# Altium project Psoc robot.PrjPcb
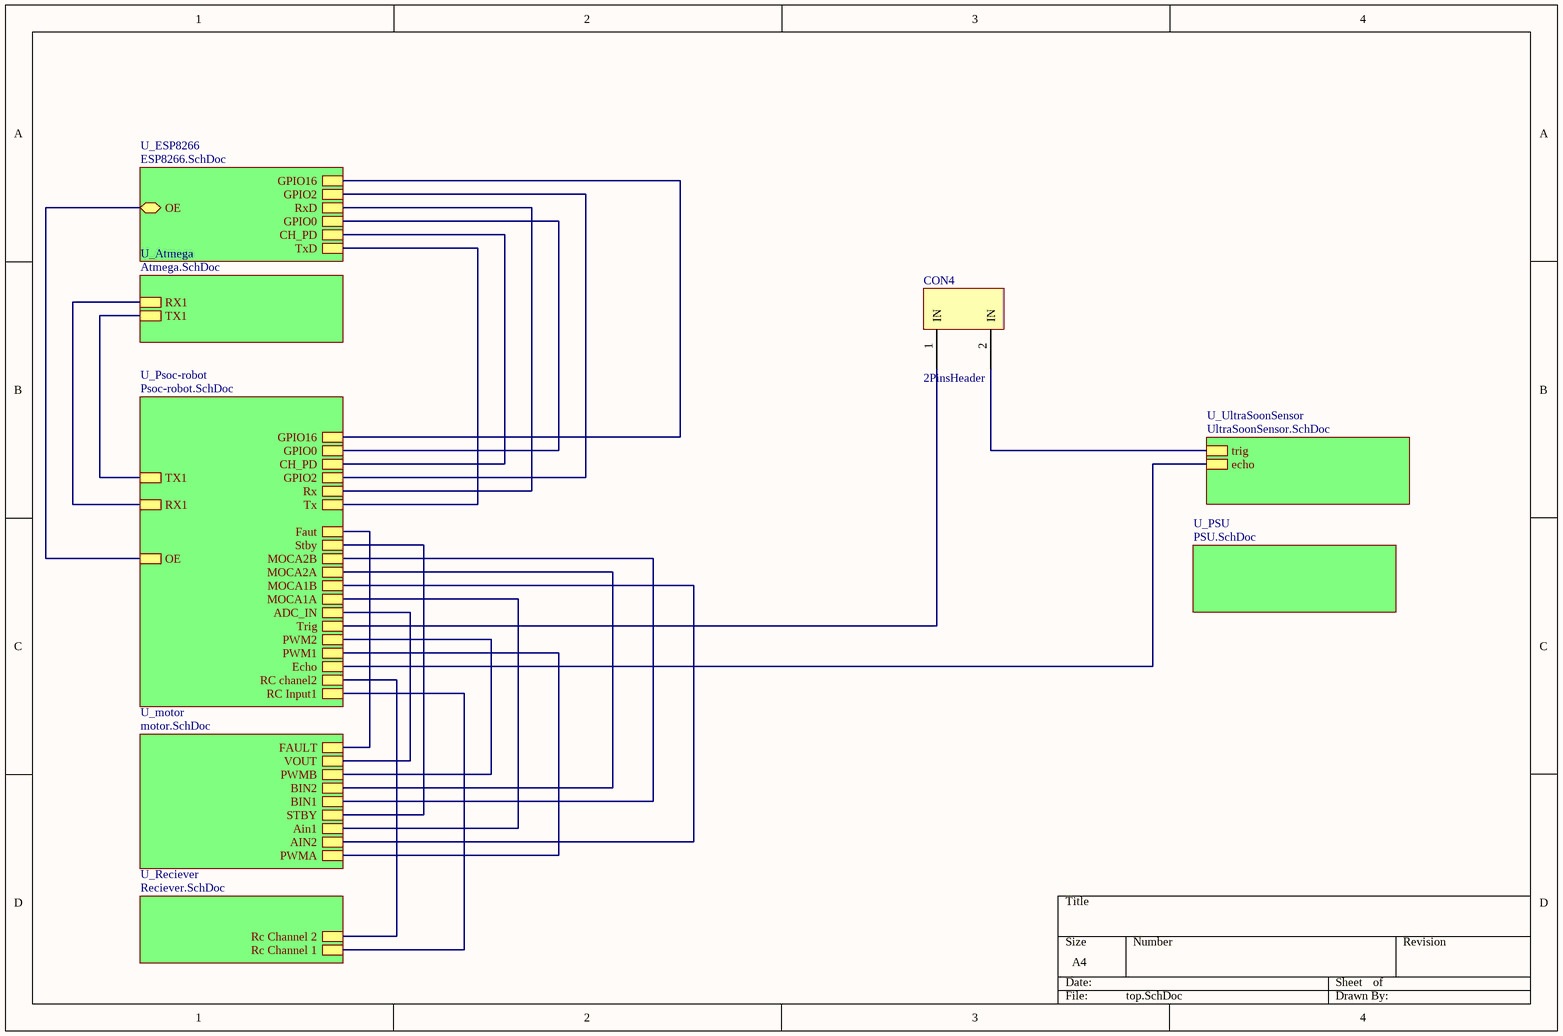
[diagram p0: top.SchDoc]
8 sheets, 48 parts. Net scope: hierarchical (ports join the sheet entries above them; power ports are global).
Board file: PsocrobotWhitESP8266.PcbDoc
Sheets:
  top.SchDoc
    U_ESP8266 = ESP8266.SchDoc
    U_UltraSoonSensor = UltraSoonSensor.SchDoc
    U_motor = motor.SchDoc
    U_PSU = PSU.SchDoc
    U_Reciever = Reciever.SchDoc
    U_Atmega = Atmega.SchDoc
    U_Psoc-robot = Psoc-robot.SchDoc

## Sheet top.SchDoc
size A4; SheetNumber: 2

### Parts
CON4  2PinsHeader  [2PinsHeader]

### Sub-sheets
U_Atmega = Atmega.SchDoc: RX1, TX1
U_ESP8266 = ESP8266.SchDoc: TxD, CH_PD, GPIO0, RxD, GPIO2, GPIO16, OE
U_motor = motor.SchDoc: PWMA, AIN2, Ain1, STBY, BIN1, BIN2, PWMB, VOUT, FAULT
U_Psoc-robot = Psoc-robot.SchDoc: RC Input1, RC chanel2, Echo, PWM1, PWM2, Trig, ADC_IN, MOCA1A, MOCA1B, MOCA2A, MOCA2B, Stby, Faut, Tx, Rx, GPIO2, CH_PD, GPIO0, GPIO16, OE, RX1, TX1
U_PSU = PSU.SchDoc: no entries
U_Reciever = Reciever.SchDoc: Rc Channel 1, Rc Channel 2
U_UltraSoonSensor = UltraSoonSensor.SchDoc: trig, echo

### Nets
NetCON4_1: CON4.1(IN) ; sheet U_Psoc-robot/Trig
NetCON4_2: CON4.2(IN) ; sheet U_UltraSoonSensor/trig
NetCON6_1: sheet U_Reciever/Rc Channel 1, sheet U_Psoc-robot/RC Input1
NetCON7_1: sheet U_Reciever/Rc Channel 2, sheet U_Psoc-robot/RC chanel2
NetR1_2: sheet U_motor/FAULT, sheet U_Psoc-robot/Faut
NetU1_15: sheet U_motor/PWMB, sheet U_Psoc-robot/PWM2
NetU1_16: sheet U_motor/BIN2, sheet U_Psoc-robot/MOCA2A
NetU1_17: sheet U_motor/BIN1, sheet U_Psoc-robot/MOCA2B
NetU1_19: sheet U_motor/STBY, sheet U_Psoc-robot/Stby
NetU1_21: sheet U_motor/Ain1, sheet U_Psoc-robot/MOCA1A
NetU1_22: sheet U_motor/AIN2, sheet U_Psoc-robot/MOCA1B
NetU1_23: sheet U_motor/PWMA, sheet U_Psoc-robot/PWM1
NetU2_7: sheet U_motor/VOUT, sheet U_Psoc-robot/ADC_IN
NetU3_1: sheet U_ESP8266/RxD, sheet U_Psoc-robot/Rx
NetU3_3: sheet U_UltraSoonSensor/echo, sheet U_Psoc-robot/Echo
NetU3_12: sheet U_Atmega/RX1, sheet U_Psoc-robot/RX1
NetU3_16: sheet U_ESP8266/GPIO16, sheet U_Psoc-robot/GPIO16
NetU3_17: sheet U_ESP8266/GPIO0, sheet U_Psoc-robot/GPIO0
NetU3_18: sheet U_ESP8266/CH_PD, sheet U_Psoc-robot/CH_PD
NetU3_20: sheet U_ESP8266/GPIO2, sheet U_Psoc-robot/GPIO2
NetU3_21: sheet U_ESP8266/OE, sheet U_Psoc-robot/OE
NetU3_25: sheet U_ESP8266/TxD, sheet U_Psoc-robot/Tx
NetU3_27: sheet U_Atmega/TX1, sheet U_Psoc-robot/TX1

## Sheet ESP8266.SchDoc
size A4; SheetNumber: 3
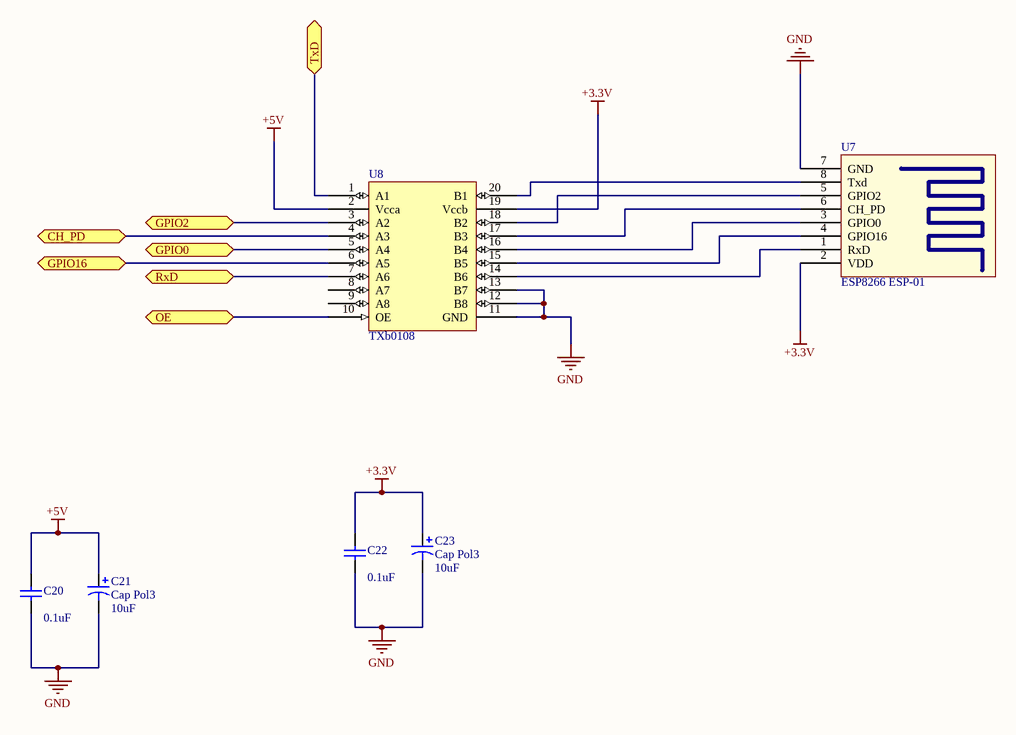
[diagram p1: ESP8266.SchDoc]

### Parts
C20  value 0.1uF  [C1206]  (hidden comment: Cap Semi)
C21  Cap Pol3  value 10uF  [C0805]
C22  value 0.1uF  [C1206]  (hidden comment: Cap Semi)
C23  Cap Pol3  value 10uF  [C0805]
U7  ESP8266 ESP-01  [ESP8266 ESP-01]
U8  TXb0108  [TXB0108]

### Ports
CH_PD, GPIO0, GPIO2, GPIO16, OE, RxD, TxD

### Nets
+3.3V: C22.1 C23.1 U7.2(VDD) U8.19(Vccb)
+5V: C20.1 C21.1 U8.2(Vcca)
GND: C20.2 C21.2 C22.2 C23.2 U7.7(GND) U8.11(GND) U8.12(B8) U8.13(B7)
NetU3_1: U8.7(A6) ; port RxD
NetU3_16: U8.6(A5) ; port GPIO16
NetU3_17: U8.5(A4) ; port GPIO0
NetU3_18: U8.4(A3) ; port CH_PD
NetU3_20: U8.3(A2) ; port GPIO2
NetU3_21: U8.10(OE) ; port OE
NetU3_25: U8.1(A1) ; port TxD
NetU7_1: U7.1(RxD) U8.14(B6)
NetU7_3: U7.3(GPIO0) U8.16(B4)
NetU7_4: U7.4(GPIO16) U8.15(B5)
NetU7_5: U7.5(GPIO2) U8.18(B2)
NetU7_6: U7.6(CH_PD) U8.17(B3)
NetU7_8: U7.8(Txd) U8.20(B1)

Not connected (* = marked no-connect by the designer): U8 8(A7) 9(A8)

### Library data of the parts
C20 C22 = Cap Semi: Capacitor (Semiconductor SIM Model); Published: 8-Jun-2000; LatestRevisionDate: 29-May-2009; LatestRevisionNote: IPC-7351 Footprint Added.; PackageReference: C1206; Publisher: Altium Limited; PackageDescription: Chip Capacitor
C21 C23 = Cap Pol3: Polarized Capacitor (Surface Mount); Published: 8-Jun-2000; LatestRevisionDate: 29-May-2009; LatestRevisionNote: IPC-7351 Footprint Added.; PackageReference: C0805; Publisher: Altium Limited; PackageDescription: Chip Capacitor

## Sheet UltraSoonSensor.SchDoc
size A4; SheetNumber: 6
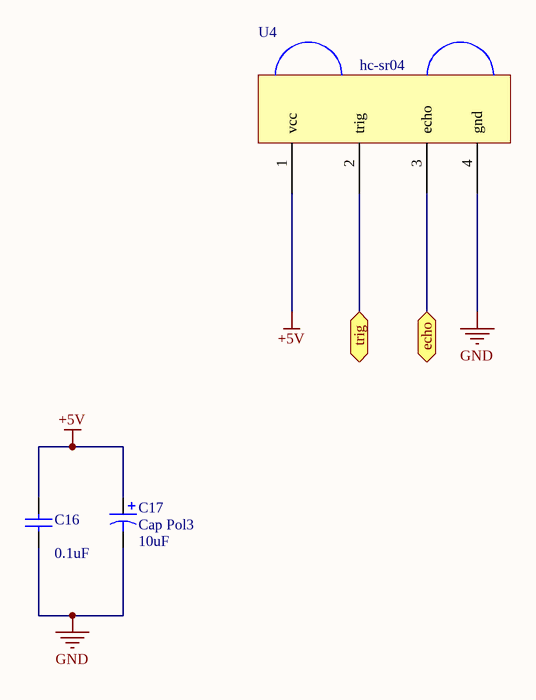
[diagram p2: UltraSoonSensor.SchDoc]

### Parts
C16  value 0.1uF  [C1206]  (hidden comment: Cap Semi)
C17  Cap Pol3  value 10uF  [C0805]
U4  hc-sr04  [ultrasoonSensor]

### Ports
echo, trig

### Nets
+5V: C16.1 C17.1 U4.1(vcc)
GND: C16.2 C17.2 U4.4(gnd)
NetCON4_2: U4.2(trig) ; port trig
NetU3_3: U4.3(echo) ; port echo

### Library data of the parts
C16 = Cap Semi: Capacitor (Semiconductor SIM Model); Published: 8-Jun-2000; LatestRevisionDate: 29-May-2009; LatestRevisionNote: IPC-7351 Footprint Added.; PackageReference: C1206; Publisher: Altium Limited; PackageDescription: Chip Capacitor
C17 = Cap Pol3: Polarized Capacitor (Surface Mount); Published: 8-Jun-2000; LatestRevisionDate: 29-May-2009; LatestRevisionNote: IPC-7351 Footprint Added.; PackageReference: C0805; Publisher: Altium Limited; PackageDescription: Chip Capacitor
U4 = Component_1

## Sheet motor.SchDoc
size A4; SheetNumber: 5
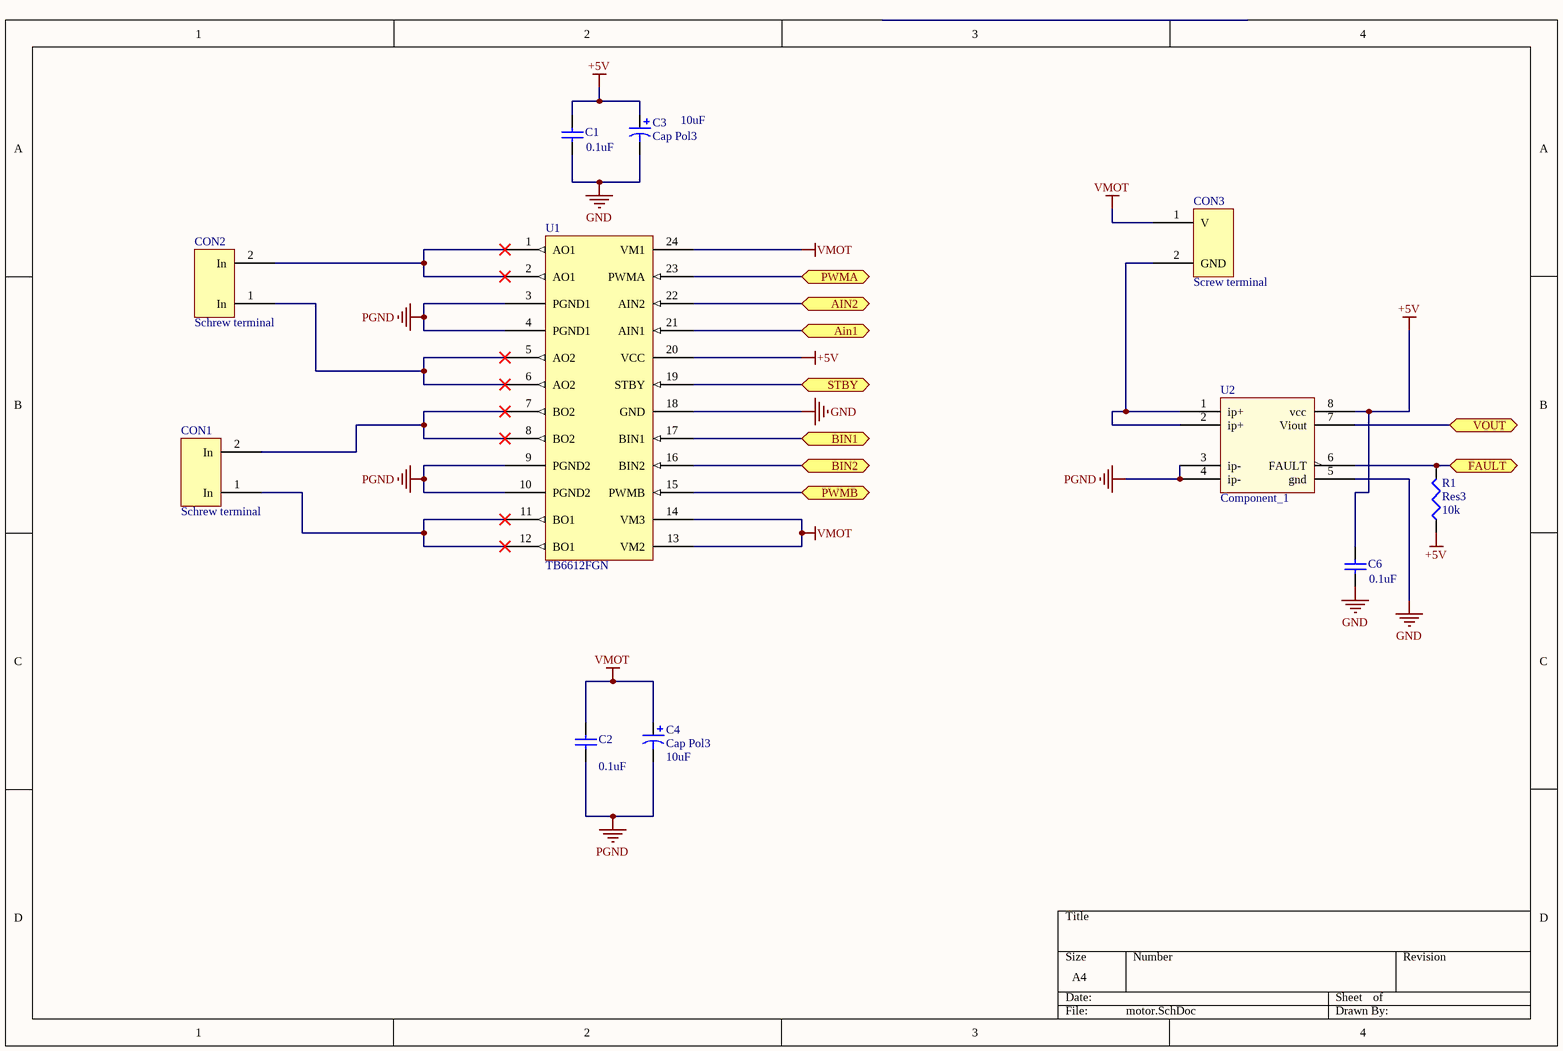
[diagram p3: motor.SchDoc]

### Parts
C1  value 0.1uF  [1608[0603]]  (hidden comment: Cap Semi)
C2  value 0.1uF  [C1206]  (hidden comment: Cap Semi)
C3  Cap Pol3  value 10uF  [C0805]
C4  Cap Pol3  value 10uF  [C0805]
C6  value 0.1uF  [1608[0603]]  (hidden comment: Cap Semi)
CON1  Schrew terminal  [ScrewTerminal]
CON2  Schrew terminal  [ScrewTerminal]
CON3  Screw terminal  [ScrewTerminal]
R1  Res3  value 10k  [J1-0603]
U1  TB6612FGN  [TBS6612FNG]
U2  Component_1  [ACS711]

### Ports
Ain1, AIN2, BIN1, BIN2, FAULT, PWMA, PWMB, STBY, VOUT

### Nets
+5V: C1.1 C3.1 C6.1 R1.1 U1.20(VCC) U2.8(vcc)
GND: C1.2 C3.2 C6.2 U1.18(GND) U2.5(gnd)
PGND: C2.2 C4.2 U1.3(PGND1) U1.4(PGND1) U1.9(PGND2) U1.10(PGND2) U2.3(ip-) U2.4(ip-)
VMOT: C2.1 C4.1 CON3.1(V) U1.13(VM2) U1.14(VM3) U1.24(VM1)
NetCON1_1: CON1.1(In) U1.11(BO1) U1.12(BO1)
NetCON1_2: CON1.2(In) U1.7(BO2) U1.8(BO2)
NetCON2_1: CON2.1(In) U1.5(AO2) U1.6(AO2)
NetCON2_2: CON2.2(In) U1.1(AO1) U1.2(AO1)
NetCON3_2: CON3.2(GND) U2.1(ip+) U2.2(ip+)
NetR1_2: R1.2 U2.6(FAULT) ; port FAULT
NetU1_15: U1.15(PWMB) ; port PWMB
NetU1_16: U1.16(BIN2) ; port BIN2
NetU1_17: U1.17(BIN1) ; port BIN1
NetU1_19: U1.19(STBY) ; port STBY
NetU1_21: U1.21(AIN1) ; port Ain1
NetU1_22: U1.22(AIN2) ; port AIN2
NetU1_23: U1.23(PWMA) ; port PWMA
NetU2_7: U2.7(Viout) ; port VOUT

### Library data of the parts
C1 C2 C6 = Cap Semi: Capacitor (Semiconductor SIM Model); Published: 8-Jun-2000; LatestRevisionDate: 29-May-2009; LatestRevisionNote: IPC-7351 Footprint Added.; PackageReference: C1206; Publisher: Altium Limited; PackageDescription: Chip Capacitor
C3 C4 = Cap Pol3: Polarized Capacitor (Surface Mount); Published: 8-Jun-2000; LatestRevisionDate: 29-May-2009; LatestRevisionNote: IPC-7351 Footprint Added.; PackageReference: C0805; Publisher: Altium Limited; PackageDescription: Chip Capacitor
CON3 = Schrew terminal
R1 = Res3: Resistor; Published: 8-Jun-2000; LatestRevisionDate: 29-May-2009; LatestRevisionNote: IPC-7351 Footprint Added.; PackageReference: J1-0603; Publisher: Altium Limited; PackageDescription: Chip Resistor

## Sheet PSU.SchDoc
size A4; SheetNumber: 1
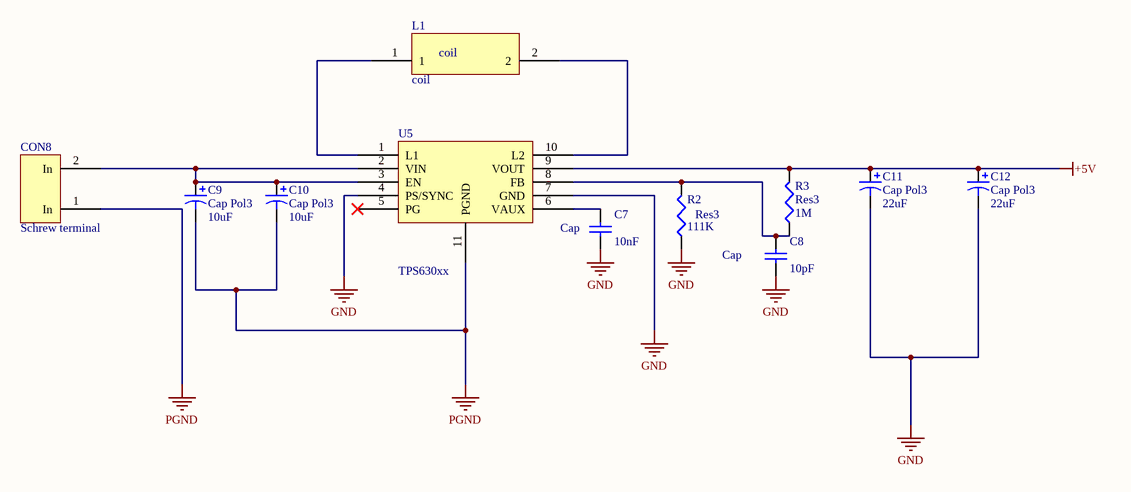
[diagram p4: PSU.SchDoc]

### Parts
C7  Cap  value 10nF  [0402]
C8  Cap  value 10pF  [0402]
C9  Cap Pol3  value 10uF  [C0805]
C10  Cap Pol3  value 10uF  [C0805]
C11  Cap Pol3  value 22uF  [C0805]
C12  Cap Pol3  value 22uF  [C0805]
CON8  Schrew terminal  [ScrewTerminal]
L1  coil  [Coil]
R2  Res3  value 111K  [J1-0603]
R3  Res3  value 1M  [J1-0603]
U5  TPS630xx  [TPS63061]

### Nets
+5V: C11.1 C12.1 R3.2 U5.9(VOUT)
GND: C7.1 C8.1 C11.2 C12.2 R2.1 U5.4(PS/SYNC) U5.7(GND)
PGND: C9.2 C10.2 CON8.1(In) U5.11(PGND)
NetC7_2: C7.2 U5.6(VAUX)
NetC8_2: C8.2 R2.2 R3.1 U5.8(FB)
NetC9_1: C9.1 C10.1 CON8.2(In) U5.2(VIN) U5.3(EN)
NetL1_1: L1.1 U5.1(L1)
NetL1_2: L1.2 U5.10(L2)

Not connected (* = marked no-connect by the designer): U5 5(PG)*

### Library data of the parts
C7 C8 = Cap Semi: Capacitor (Semiconductor SIM Model); Published: 8-Jun-2000; LatestRevisionDate: 29-May-2009; LatestRevisionNote: IPC-7351 Footprint Added.; PackageReference: C1206; Publisher: Altium Limited; PackageDescription: Chip Capacitor
C9-C12 = Cap Pol3: Polarized Capacitor (Surface Mount); Published: 8-Jun-2000; LatestRevisionDate: 29-May-2009; LatestRevisionNote: IPC-7351 Footprint Added.; PackageReference: C0805; Publisher: Altium Limited; PackageDescription: Chip Capacitor
R2 R3 = Res3: Resistor; Published: 8-Jun-2000; LatestRevisionDate: 29-May-2009; LatestRevisionNote: IPC-7351 Footprint Added.; PackageReference: J1-0603; Publisher: Altium Limited; PackageDescription: Chip Resistor

## Sheet Reciever.SchDoc
size A4; SheetNumber: 7
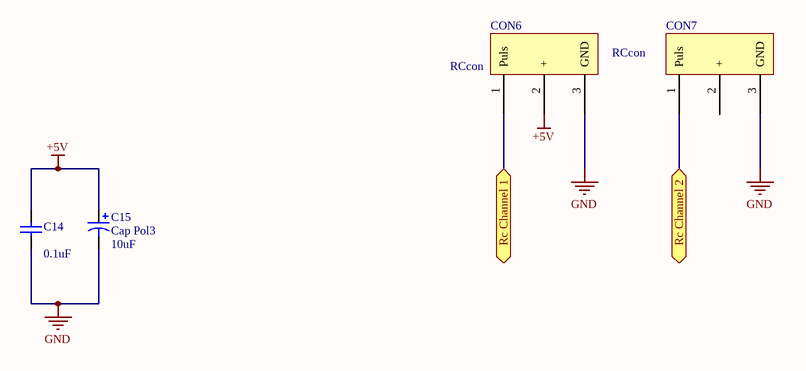
[diagram p5: Reciever.SchDoc]

### Parts
C14  value 0.1uF  [C1206]  (hidden comment: Cap Semi)
C15  Cap Pol3  value 10uF  [C0805]
CON6  RCcon  [RcCon]
CON7  RCcon  [RcCon]

### Ports
Rc Channel 1, Rc Channel 2

### Nets
+5V: C14.1 C15.1 CON6.2(+)
GND: C14.2 C15.2 CON6.3(GND) CON7.3(GND)
NetCON6_1: CON6.1(Puls) ; port Rc Channel 1
NetCON7_1: CON7.1(Puls) ; port Rc Channel 2

Not connected (* = marked no-connect by the designer): CON7 2(+)

### Library data of the parts
C14 = Cap Semi: Capacitor (Semiconductor SIM Model); Published: 8-Jun-2000; LatestRevisionDate: 29-May-2009; LatestRevisionNote: IPC-7351 Footprint Added.; PackageReference: C1206; Publisher: Altium Limited; PackageDescription: Chip Capacitor
C15 = Cap Pol3: Polarized Capacitor (Surface Mount); Published: 8-Jun-2000; LatestRevisionDate: 29-May-2009; LatestRevisionNote: IPC-7351 Footprint Added.; PackageReference: C0805; Publisher: Altium Limited; PackageDescription: Chip Capacitor
CON6 CON7 = Rc con

## Sheet Atmega.SchDoc
size A4
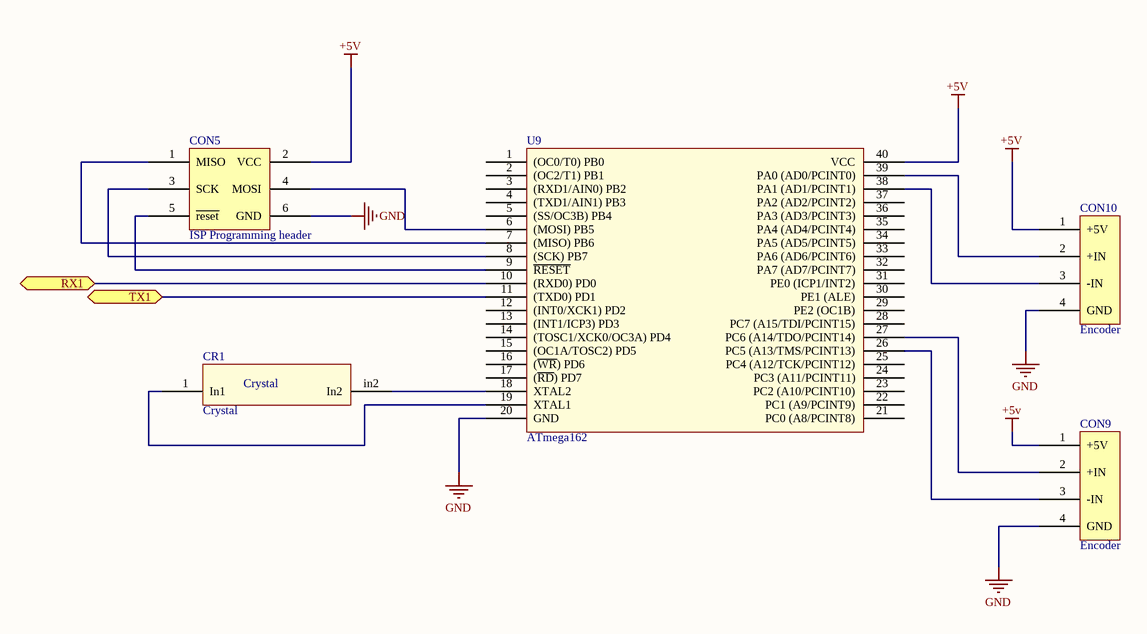
[diagram p6: Atmega.SchDoc]

### Parts
CON5  ISP Programming header  [ISP programming header]
CON9  Encoder
CON10  Encoder
CR1  Crystal  [Crystal]
U9  ATmega162  [ATmega162]

### Ports
RX1, TX1

### Nets
+5V: CON5.2(VCC) CON9.1(+5V) CON10.1(+5V) U9.40(VCC)
GND: CON5.6(GND) CON9.4(GND) CON10.4(GND) U9.20(GND)
NetCON5_1: CON5.1(MISO) U9.7((MISO)_PB6)
NetCON5_3: CON5.3(SCK) U9.8((SCK)_PB7)
NetCON5_4: CON5.4(MOSI) U9.6((MOSI)_PB5)
NetCON5_5: CON5.5(~{reset}) U9.9(~{RESET})
NetCON9_2: CON9.2(+IN) U9.27(PC6_(A14/TDO/PCINT14))
NetCON9_3: CON9.3(-IN) U9.26(PC5_(A13/TMS/PCINT13))
NetCON10_2: CON10.2(+IN) U9.39(PA0_(AD0/PCINT0))
NetCON10_3: CON10.3(-IN) U9.38(PA1_(AD1/PCINT1))
NetCR1_1: CR1.1(In1) U9.19(XTAL1)
NetCR1_in2: CR1.in2(In2) U9.18(XTAL2)
NetU3_12: U9.10((RXD0)_PD0) ; port RX1
NetU3_27: U9.11((TXD0)_PD1) ; port TX1

Not connected (* = marked no-connect by the designer): U9 1((OC0/T0)_PB0) 2((OC2/T1)_PB1) 3((RXD1/AIN0)_PB2) 4((TXD1/AIN1)_PB3) 5((SS/OC3B)_PB4) 12((INT0/XCK1)_PD2) 13((INT1/ICP3)_PD3) 14((TOSC1/XCK0/OC3A)_PD4) 15((OC1A/TOSC2)_PD5) 16((~{WR})_PD6) 17((~{RD})_PD7) 21(PC0_(A8/PCINT8)) 22(PC1_(A9/PCINT9)) 23(PC2_(A10/PCINT10)) 24(PC3_(A11/PCINT11)) 25(PC4_(A12/TCK/PCINT12)) 28(PC7_(A15/TDI/PCINT15)) 29(PE2_(OC1B)) 30(PE1_(ALE)) 31(PE0_(ICP1/INT2)) 32(PA7_(AD7/PCINT7)) 33(PA6_(AD6/PCINT6)) 34(PA5_(AD5/PCINT5)) 35(PA4_(AD4/PCINT4)) 36(PA3_(AD3/PCINT3)) 37(PA2_(AD2/PCINT2))

## Sheet Psoc-robot.SchDoc
size A4; SheetNumber: 4
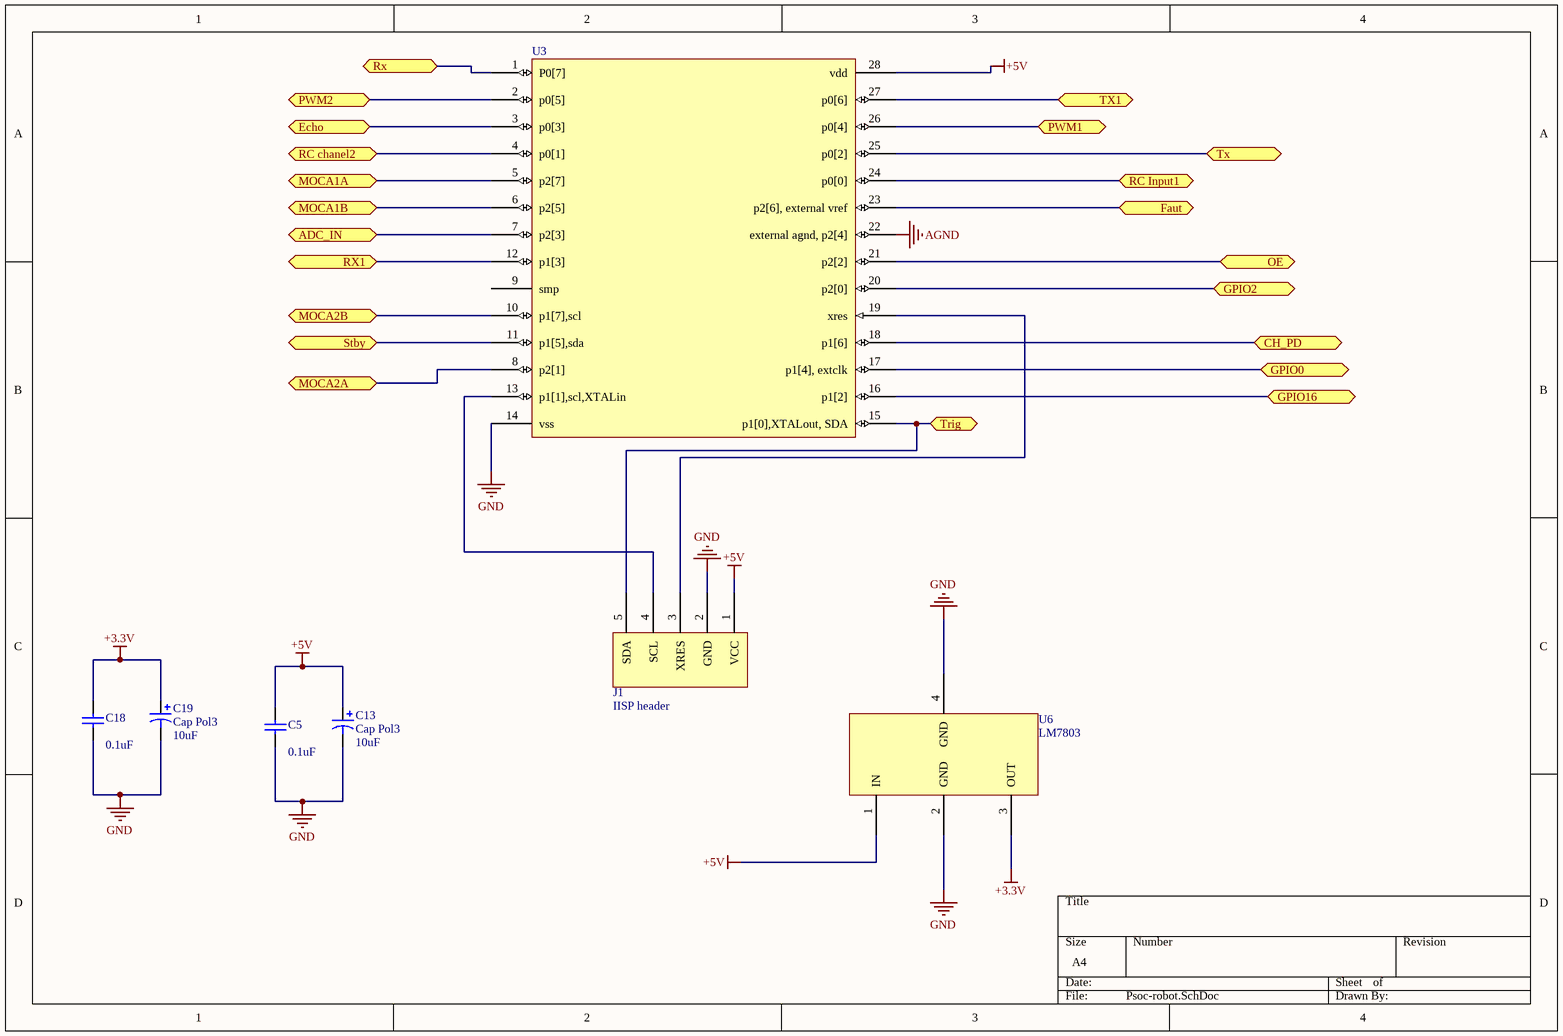
[diagram p7: Psoc-robot.SchDoc]

### Parts
C5  value 0.1uF  [C1206]  (hidden comment: Cap Semi)
C13  Cap Pol3  value 10uF  [C0805]
C18  value 0.1uF  [C1206]  (hidden comment: Cap Semi)
C19  Cap Pol3  value 10uF  [C0805]
J1  IISP header  [Programm header]
U3  Component_1  [CY8C29466]  (value not drawn)
U6  LM7803  [LM7805]

### Ports
ADC_IN, CH_PD, Echo, Faut, GPIO0, GPIO2, GPIO16, MOCA1A, MOCA1B, MOCA2A, MOCA2B, OE, PWM1, PWM2, RC chanel2, RC Input1, Rx, RX1, Stby, Trig, Tx, TX1

### Nets
+3.3V: C18.1 C19.1 U6.3(OUT)
+5V: C5.1 C13.1 J1.1(VCC) U3.28(vdd) U6.1(IN)
AGND: U3.22(external_agnd,_p2[4])
GND: C5.2 C13.2 C18.2 C19.2 J1.2(GND) U3.14(vss) U6.2(GND) U6.4(GND)
NetCON4_1: J1.5(SDA) U3.15(p1[0],XTALout,_SDA) ; port Trig
NetCON6_1: U3.24(p0[0]) ; port RC Input1
NetCON7_1: U3.4(p0[1]) ; port RC chanel2
NetJ1_3: J1.3(XRES) U3.19(xres)
NetJ1_4: J1.4(SCL) U3.13(p1[1],scl,XTALin)
NetR1_2: U3.23(p2[6],_external_vref) ; port Faut
NetU1_15: U3.2(p0[5]) ; port PWM2
NetU1_16: U3.8(p2[1]) ; port MOCA2A
NetU1_17: U3.10(p1[7],scl) ; port MOCA2B
NetU1_19: U3.11(p1[5],sda) ; port Stby
NetU1_21: U3.5(p2[7]) ; port MOCA1A
NetU1_22: U3.6(p2[5]) ; port MOCA1B
NetU1_23: U3.26(p0[4]) ; port PWM1
NetU2_7: U3.7(p2[3]) ; port ADC_IN
NetU3_1: U3.1(P0[7]) ; port Rx
NetU3_3: U3.3(p0[3]) ; port Echo
NetU3_12: U3.12(p1[3]) ; port RX1
NetU3_16: U3.16(p1[2]) ; port GPIO16
NetU3_17: U3.17(p1[4],_extclk) ; port GPIO0
NetU3_18: U3.18(p1[6]) ; port CH_PD
NetU3_20: U3.20(p2[0]) ; port GPIO2
NetU3_21: U3.21(p2[2]) ; port OE
NetU3_25: U3.25(p0[2]) ; port Tx
NetU3_27: U3.27(p0[6]) ; port TX1

Not connected (* = marked no-connect by the designer): U3 9(smp)

### Library data of the parts
C5 C18 = Cap Semi: Capacitor (Semiconductor SIM Model); Published: 8-Jun-2000; LatestRevisionDate: 29-May-2009; LatestRevisionNote: IPC-7351 Footprint Added.; PackageReference: C1206; Publisher: Altium Limited; PackageDescription: Chip Capacitor
C13 C19 = Cap Pol3: Polarized Capacitor (Surface Mount); Published: 8-Jun-2000; LatestRevisionDate: 29-May-2009; LatestRevisionNote: IPC-7351 Footprint Added.; PackageReference: C0805; Publisher: Altium Limited; PackageDescription: Chip Capacitor

## Nets that join several sheets
+3.3V: ESP8266 (C22.1 C23.1 U7.2 U8.19), Psoc-robot (C18.1 C19.1 U6.3)
+5V: ESP8266 (C20.1 C21.1 U8.2), UltraSoonSensor (C16.1 C17.1 U4.1), motor (6 pins), PSU (C11.1 C12.1 R3.2 U5.9), Reciever (C14.1 C15.1 CON6.2), Atmega (CON5.2 CON9.1 CON10.1 U9.40), Psoc-robot (5 pins)
GND: ESP8266 (8 pins), UltraSoonSensor (C16.2 C17.2 U4.4), motor (5 pins), PSU (7 pins), Reciever (C14.2 C15.2 CON6.3 CON7.3), Atmega (CON5.6 CON9.4 CON10.4 U9.20), Psoc-robot (8 pins)
PGND: motor (8 pins), PSU (C9.2 C10.2 CON8.1 U5.11)
NetCON4_1: top (CON4.1), Psoc-robot (J1.5 U3.15)
NetCON4_2: top (CON4.2), UltraSoonSensor (U4.2)
NetCON6_1: Reciever (CON6.1), Psoc-robot (U3.24)
NetCON7_1: Reciever (CON7.1), Psoc-robot (U3.4)
NetR1_2: motor (R1.2 U2.6), Psoc-robot (U3.23)
NetU1_15: motor (U1.15), Psoc-robot (U3.2)
NetU1_16: motor (U1.16), Psoc-robot (U3.8)
NetU1_17: motor (U1.17), Psoc-robot (U3.10)
NetU1_19: motor (U1.19), Psoc-robot (U3.11)
NetU1_21: motor (U1.21), Psoc-robot (U3.5)
NetU1_22: motor (U1.22), Psoc-robot (U3.6)
NetU1_23: motor (U1.23), Psoc-robot (U3.26)
NetU2_7: motor (U2.7), Psoc-robot (U3.7)
NetU3_1: ESP8266 (U8.7), Psoc-robot (U3.1)
NetU3_3: UltraSoonSensor (U4.3), Psoc-robot (U3.3)
NetU3_12: Atmega (U9.10), Psoc-robot (U3.12)
NetU3_16: ESP8266 (U8.6), Psoc-robot (U3.16)
NetU3_17: ESP8266 (U8.5), Psoc-robot (U3.17)
NetU3_18: ESP8266 (U8.4), Psoc-robot (U3.18)
NetU3_20: ESP8266 (U8.3), Psoc-robot (U3.20)
NetU3_21: ESP8266 (U8.10), Psoc-robot (U3.21)
NetU3_25: ESP8266 (U8.1), Psoc-robot (U3.25)
NetU3_27: Atmega (U9.11), Psoc-robot (U3.27)